# EAGLE schematic pic16f1829_ads1232_ads1220_hx711 (EAGLE 9.6.2)
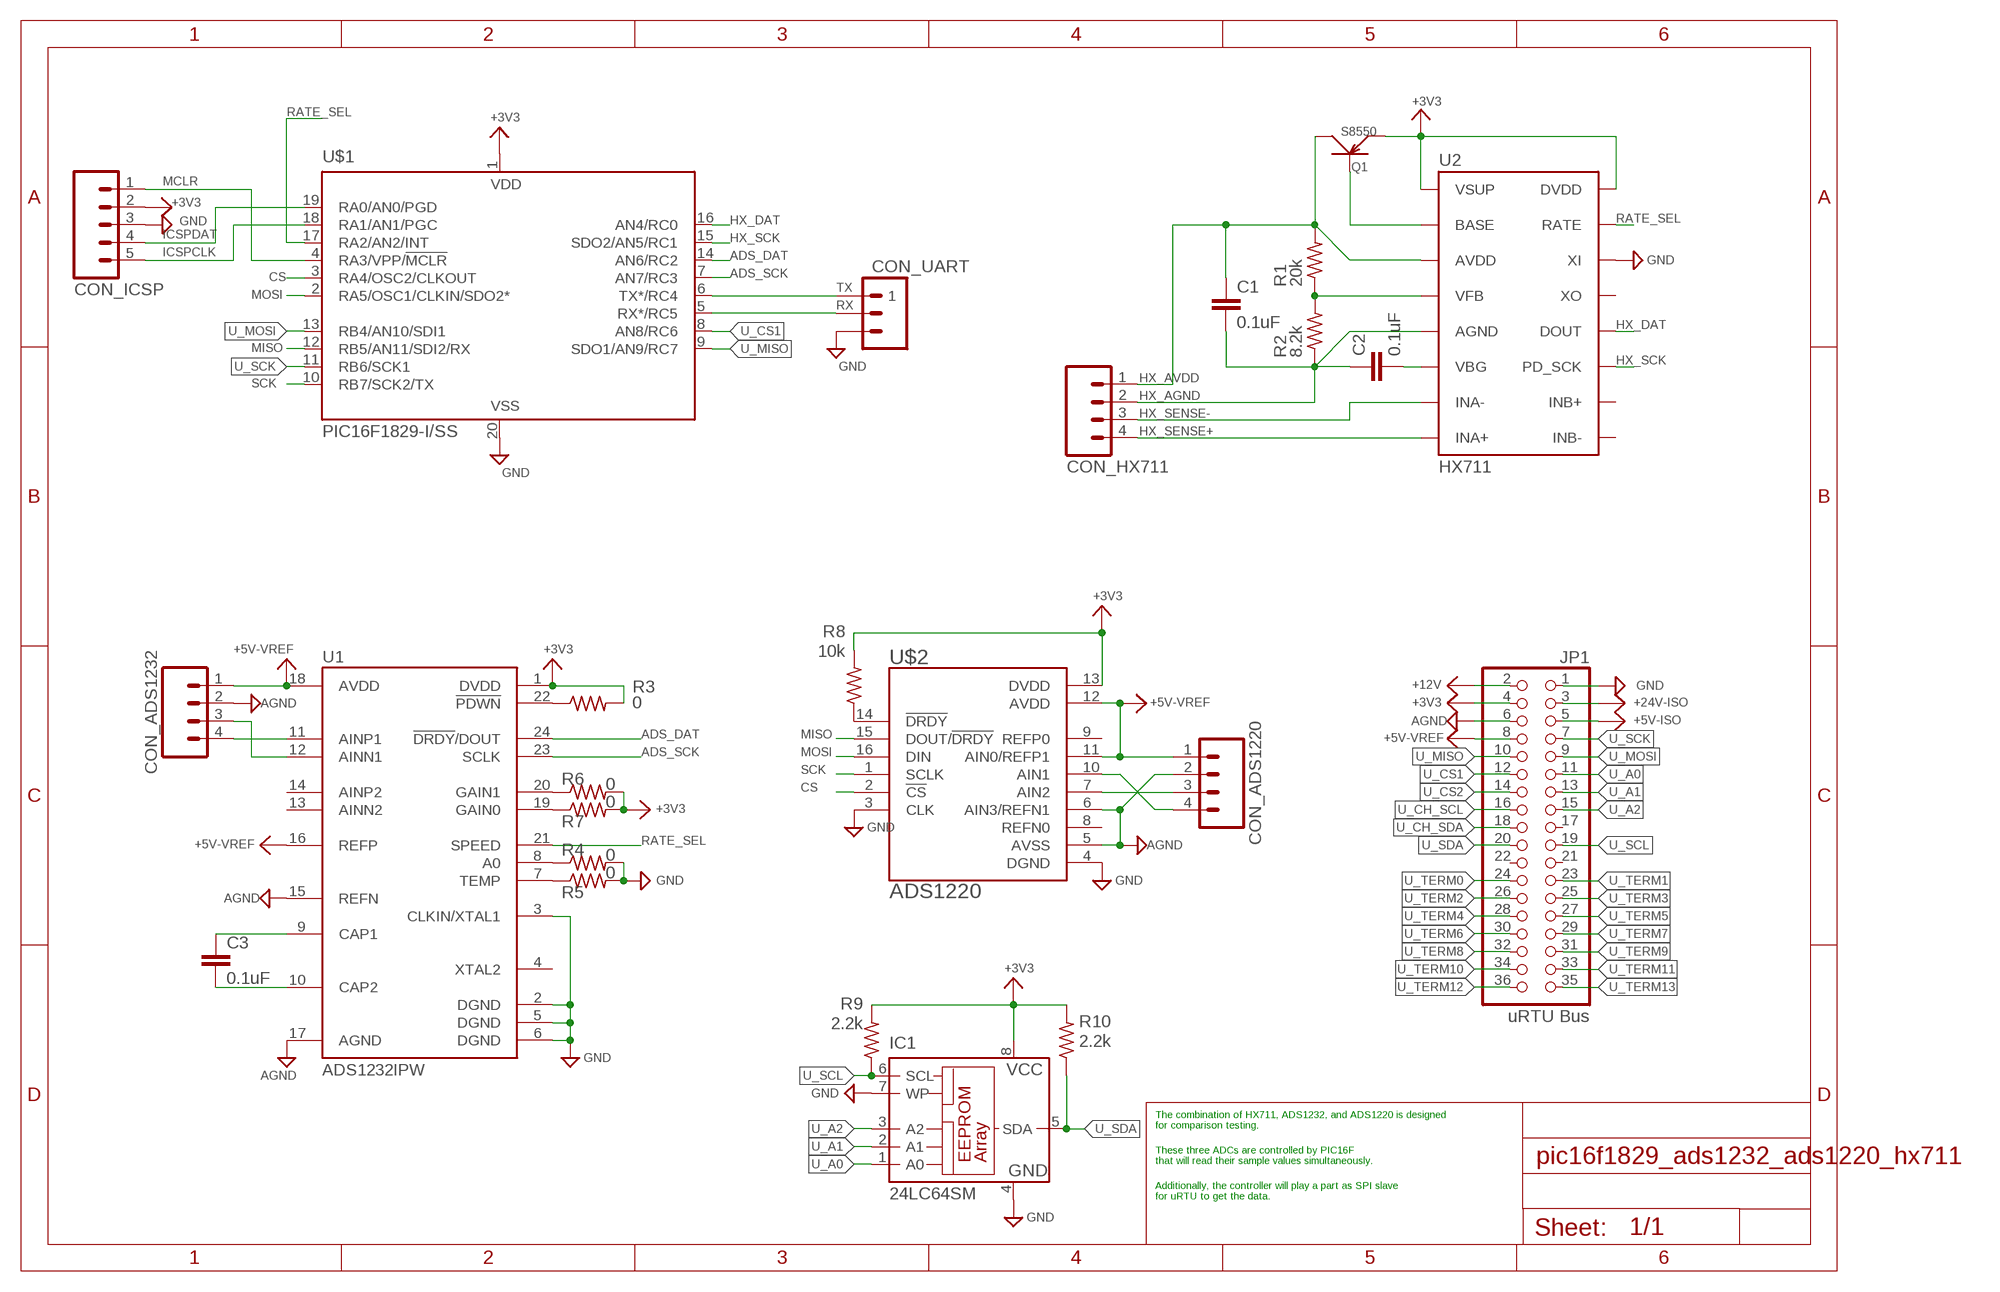
[diagram p0: schematic, sheet 1]

## Parts
C1  0.1uF  RCL_C-EUC0805  [RCL_C0805]
C2  0.1uF  RCL_C-EUC0805  [RCL_C0805]
C3  0.1uF  RCL_C-EUC0805  [RCL_C0805]
CON_ADS1220  M04PTH  [1X04]
CON_ADS1232  M04PTH  [1X04]
CON_HX711  M04PTH  [1X04]
CON_ICSP  M05  [1X05]
CON_UART  M03  [1X03]
IC1  24LC64SM  [SO-08M]
JP1  uRTU Bus  PINHD-2X18  [2X18]
Q1  S8550  SMD-TRANSISTORS-PNP-25V-500MA-S8550(SOT-23)  [SOT-23]
R1  20k  RCL_R-USM0805  [RCL_M0805]
R2  8.2k  RCL_R-USM0805  [RCL_M0805]
R3  0  RCL_R-USM0805  [RCL_M0805]
R4  0  RCL_R-USM0805  [RCL_M0805]
R5  0  RCL_R-USM0805  [RCL_M0805]
R6  0  RCL_R-USM0805  [RCL_M0805]
R7  0  RCL_R-USM0805  [RCL_M0805]
R8  10k  RCL_R-USM0805  [RCL_M0805]
R9  2.2k  RCL_R-USM0805  [RCL_M0805]
R10  2.2k  RCL_R-USM0805  [RCL_M0805]
U1  ADS1232IPW  [TSSOP24]
U2  HX711  [SO16]
U$1  PIC16F1829-I/SS  PIC16F1829  [SSOP20]
U$2  ADS1220  [TSSOP-16]

## Nets
+3V3: CON_ICSP.2 IC1.8(VCC) JP1.4 Q1.2(E) R3.2 R6.2 R7.2 R8.2 R9.2 R10.2 U1.1(DVDD) U2.1(VSUP) U2.16(DVDD) U$1.1(VDD) U$2.13(DVDD)
+5V-ISO: JP1.5
+5V-VREF: CON_ADS1220.1 CON_ADS1232.1 JP1.8 U1.16(REFP) U1.18(AVDD) U$2.11(AIN0/REFP1) U$2.12(AVDD)
+12V: JP1.2
+24V-ISO: JP1.3
ADS_DAT: U1.24(!DRDY!/DOUT) U$1.14(AN6/RC2)
ADS_SCK: U1.23(SCLK) U$1.7(AN7/RC3)
AGND: CON_ADS1220.2 CON_ADS1232.2 JP1.6 U1.15(REFN) U1.17(AGND) U$2.5(AVSS) U$2.6(AIN3/REFN1)
CS: U$1.3(RA4/OSC2/CLKOUT) U$2.2(!CS)
GND: CON_ICSP.3 CON_UART.3 IC1.4(GND) IC1.7(WP) JP1.1 R4.2 R5.2 U1.2(DGND) U1.3(CLKIN/XTAL1) U1.5(DGND) U1.6(DGND) U2.14(XI) U$1.20(VSS) U$2.3(CLK) U$2.4(DGND)
HX_AGND: C1.2 C2.1 CON_HX711.2 R2.1 U2.5(AGND)
HX_AVDD: C1.1 CON_HX711.1 Q1.3(C) R1.2 U2.3(AVDD)
HX_DAT: U2.12(DOUT) U$1.16(AN4/RC0)
HX_SCK: U2.11(PD_SCK) U$1.15(SDO2/AN5/RC1)
HX_SENSE+: CON_HX711.4 U2.8(INA+)
HX_SENSE-: CON_HX711.3 U2.7(INA-)
ICSPCLK: CON_ICSP.5 U$1.18(RA1/AN1/PGC)
ICSPDAT: CON_ICSP.4 U$1.19(RA0/AN0/PGD)
MCLR: CON_ICSP.1 U$1.4(RA3/VPP/!MCLR)
MISO: U$1.12(RB5/AN11/SDI2/RX) U$2.15(DOUT/!DRDY)
MOSI: U$1.2(RA5/OSC1/CLKIN/SDO2*) U$2.16(DIN)
N$1: R3.1 U1.22(!PDWN)
N$2: CON_ADS1232.4 U1.11(AINP1)
N$3: C2.2 U2.6(VBG)
N$4: R1.1 R2.2 U2.4(VFB)
N$5: CON_ADS1232.3 U1.12(AINN1)
N$6: CON_ADS1220.3 U$2.7(AIN2)
N$7: Q1.1(B) U2.2(BASE)
N$8: CON_ADS1220.4 U$2.10(AIN1)
N$9: C3.1 U1.9(CAP1)
N$10: C3.2 U1.10(CAP2)
N$11: R4.1 U1.8(A0)
N$12: R5.1 U1.7(TEMP)
N$13: R7.1 U1.19(GAIN0)
N$14: R6.1 U1.20(GAIN1)
N$15: R8.1 U$2.14(!DRDY)
RATE_SEL: U1.21(SPEED) U2.15(RATE) U$1.17(RA2/AN2/INT)
RX: CON_UART.2 U$1.5(RX*/RC5)
SCK: U$1.10(RB7/SCK2/TX) U$2.1(SCLK)
TX: CON_UART.1 U$1.6(TX*/RC4)
U_A0: IC1.1(A0) JP1.11
U_A1: IC1.2(A1) JP1.13
U_A2: IC1.3(A2) JP1.15
U_CH_SCL: JP1.16
U_CH_SDA: JP1.18
U_CS1: JP1.12 U$1.8(AN8/RC6)
U_CS2: JP1.14
U_MISO: JP1.10 U$1.9(SDO1/AN9/RC7)
U_MOSI: JP1.9 U$1.13(RB4/AN10/SDI1)
U_SCK: JP1.7 U$1.11(RB6/SCK1)
U_SCL: IC1.6(SCL) JP1.19 R9.1
U_SDA: IC1.5(SDA) JP1.20 R10.1
U_TERM0: JP1.24
U_TERM1: JP1.23
U_TERM2: JP1.26
U_TERM3: JP1.25
U_TERM4: JP1.28
U_TERM5: JP1.27
U_TERM6: JP1.30
U_TERM7: JP1.29
U_TERM8: JP1.32
U_TERM9: JP1.31
U_TERM10: JP1.34
U_TERM11: JP1.33
U_TERM12: JP1.36
U_TERM13: JP1.35
Unconnected: JP1.17 JP1.21 JP1.22 U1.4(XTAL2) U1.13(AINN2) U1.14(AINP2) U2.9(INB-) U2.10(INB+) U2.13(XO) U$2.8(REFN0) U$2.9(REFP0)

## Notes on the sheet
- The combination of HX711, ADS1232, and ADS1220 is designed 
  for comparison testing.
- These three ADCs are controlled by PIC16F 
  that will read their sample values simultaneously.
- Additionally, the controller will play a part as SPI slave 
  for uRTU to get the data.

## Library data of the parts
C1-C3 = ipas:RCL_C-EU: CAPACITOR, European symbol
CON_ADS1220 CON_ADS1232 CON_HX711 = ipas:M04: Header 4 Standard 4-pin 0.1" header. Use with straight break away headers (SKU : PRT-00116), right angle break away headers (PRT-00553), swiss pins (PRT-00743), machine pins (PRT-00117), and female headers (PRT-00115). Molex polarized connector foot print use with SKU : PRT-08231 with associated crimp pins and housings. 1MM SMD Version SKU: PRT-10208
CON_ICSP = ipas:M05: Header 5 Standard 5-pin 0.1" header. Use with straight break away headers (SKU : PRT-00116), right angle break away headers (PRT-00553), swiss pins (PRT-00743), machine pins (PRT-00117), and female headers (PRT-00115).
CON_UART = ipas:M03: Header 4 Standard 4-pin 0.1" header. Use with straight break away headers (SKU : PRT-00116), right angle break away headers (PRT-00553), swiss pins (PRT-00743), machine pins (PRT-00117), and female headers (PRT-00115). Molex polarized connector foot print use with SKU : PRT-08231 with associated crimp pins and housings. 1MM SMD Version SKU: PRT-10208
IC1 = microchip:24*: Serial EEPROM I2C; MF: MICROCHIP; MPN: 24LC64T-I/SN; OC_FARNELL: 9758070; OC_NEWARK: 12C2021
JP1 = pinhead:PINHD-2X18: PIN HEADER
Q1 = OPL_Discrete_Semiconductor:SMD-TRANSISTORS-PNP-25V-500MA-S8550(SOT-23): 305020006; MPN: S8550
R1-R10 = ipas:RCL_R-US: RESISTOR, American symbol
U1 = ipas:ADS1232*: ADS1232 Texas Instruments 24-Bit Analog-to-Digital Converter For Bridge Sensors Package: TSSOP-24 (TI-postfix "PW") Dipl.-Ing. FH Rainer Bayer Hochschule Heilbronn – rainer.bayer@hs-heilbronn.de Ingenieurbüro ing-rb – eagle@ing-rb.de
U2 = SparkFun-IC-Conversion:HX711: AVIA Semiconductor HX711 - ADC 24-Bit Analog-to-Digital Converter for Weigh Scales Datasheet <https://cdn.sparkfun.com/datasheets/Sensors/ForceFlex/hx711_english.pdf> SparkFun Products: SparkFun Load Cell Amplifier - HX711 <https://www.sparkfun.com/products/13879>; PROD_ID: IC-12445
U$1 = SparkFun-IC-Microcontroller:PIC16F1829: PIC16F1829-I/SS SparkFun Products SparkFun Touch Potentiometer <https://www.sparkfun.com/products/13144> (PRT-13144); PROD_ID: IC-12357
U$2 = ipas:ADS1220